# Altium schematic sheet HVSystem.SchDoc
size A4
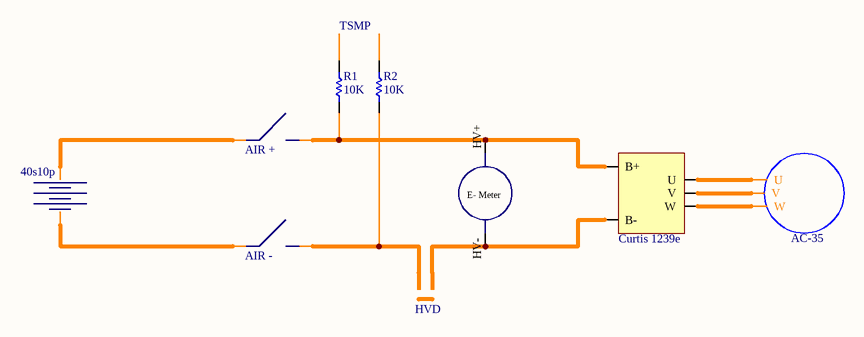
[diagram p0: HVSystem.SchDoc]

## Parts
*  HVD
AIR+  AIR +
AIR-  AIR -
battery  40s10p
inverter  Curtis 1239e
meter  E-meter  (value not drawn)
motor  AC-35
R1  10K
R2  10K

## Nets
NetAIR+_1: AIR+.1 battery.1
NetAIR+_2: AIR+.2 inverter.2(B+) meter.HV+ R1.1
NetAIR-_1: AIR-.1 battery.2
NetAIR-_2: AIR-.2 R2.1
Netinverter_1: inverter.1(B-) meter.HV-
Netinverter_3: inverter.3(U) motor.3(U)
Netinverter_4: inverter.4(V) motor.4(V)
Netinverter_5: inverter.5(W) motor.5(W)

Not connected (* = marked no-connect by the designer): R1 2; R2 2

## Notes on the sheet
- TSMP
- (in symbol E-meter) E- Meter /

## Library data of the parts
AIR+ AIR- = AIR
battery = Battery
inverter = Inverter
motor = Motor
R1 R2 = RES